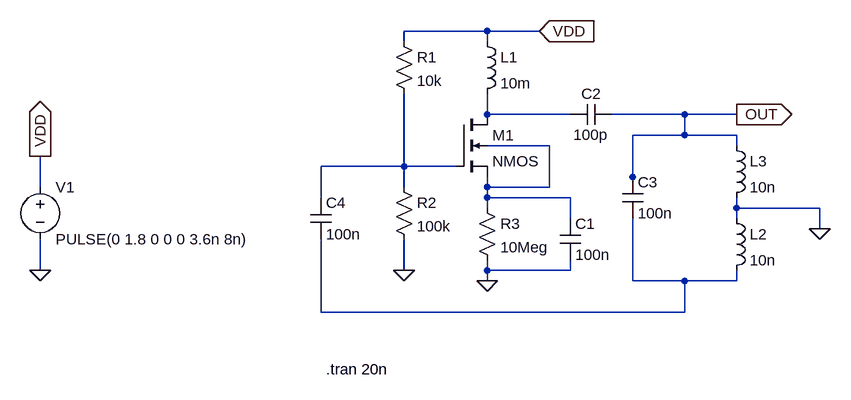
[diagram p0: schematic hartley_osc.asc]
hartley_osc.asc, the LTspice schematic file:
Version 4
SHEET 1 880 680
WIRE 256 16 128 16
WIRE 336 16 256 16
WIRE 128 32 128 16
WIRE 256 32 256 16
WIRE 256 144 256 112
WIRE 384 144 256 144
WIRE 560 144 448 144
WIRE 640 144 560 144
WIRE 560 176 560 144
WIRE 560 176 480 176
WIRE 640 176 560 176
WIRE 352 192 256 192
WIRE 640 192 640 176
WIRE 128 224 128 112
WIRE 128 224 0 224
WIRE 208 224 128 224
WIRE 480 240 480 176
WIRE -432 256 -432 208
WIRE 128 256 128 224
WIRE 256 256 256 240
WIRE 352 256 352 192
WIRE 352 256 256 256
WIRE 480 256 480 240
WIRE 0 272 0 224
WIRE 256 272 256 256
WIRE 384 272 256 272
WIRE 256 288 256 272
WIRE 640 288 640 272
WIRE 768 288 640 288
WIRE 384 304 384 272
WIRE 640 304 640 288
WIRE 768 320 768 288
WIRE -432 384 -432 336
WIRE 128 384 128 336
WIRE 256 384 256 368
WIRE 384 384 384 368
WIRE 384 384 256 384
WIRE 256 400 256 384
WIRE 480 400 480 304
WIRE 560 400 480 400
WIRE 640 400 640 384
WIRE 640 400 560 400
WIRE 0 448 0 336
WIRE 560 448 560 400
WIRE 560 448 0 448
FLAG 256 400 0
FLAG 128 384 0
FLAG 768 320 0
FLAG 336 16 VDD
IOPIN 336 16 In
FLAG 640 144 OUT
IOPIN 640 144 Out
FLAG -432 208 VDD
IOPIN -432 208 Out
FLAG -432 384 0
SYMBOL res 112 16 R0
SYMATTR InstName R1
SYMATTR Value 10k
SYMBOL res 112 240 R0
SYMATTR InstName R2
SYMATTR Value 100k
SYMBOL nmos4 208 144 R0
SYMATTR InstName M1
SYMBOL ind 240 16 R0
SYMATTR InstName L1
SYMATTR Value 10m
SYMBOL res 240 272 R0
SYMATTR InstName R3
SYMATTR Value 10Meg
SYMBOL cap 368 304 R0
SYMATTR InstName C1
SYMATTR Value 100n
SYMBOL cap 448 128 R90
WINDOW 0 0 32 VBottom 2
WINDOW 3 32 32 VTop 2
SYMATTR InstName C2
SYMATTR Value 100p
SYMBOL cap 464 240 R0
SYMATTR InstName C3
SYMATTR Value 100n
SYMBOL ind 624 288 R0
SYMATTR InstName L2
SYMATTR Value 10n
SYMBOL ind 624 176 R0
SYMATTR InstName L3
SYMATTR Value 10n
SYMBOL cap -16 272 R0
SYMATTR InstName C4
SYMATTR Value 100n
SYMBOL voltage -432 240 R0
WINDOW 123 0 0 Left 0
WINDOW 39 0 0 Left 0
SYMATTR InstName V1
SYMATTR Value PULSE(0 1.8 0 0 0 3.6n 8n)
TEXT 8 536 Left 2 !.tran 20n

The netlist it stands for:
* hartley_osc.asc
R1 VDD N003 10k
R2 N003 0 100k
M1 N001 N003 N002 N002 NMOS
L1 VDD N001 10m
R3 N002 0 10Meg
C1 N002 0 100n
C2 OUT N001 100p
C3 OUT N004 100n
L2 0 N004 10n
L3 OUT 0 10n
C4 N003 N004 100n
V1 VDD 0 PULSE(0 1.8 0 0 0 3.6n 8n)
.model NMOS NMOS
.model PMOS PMOS
.lib standard.mos
.tran 20n
.backanno
.end